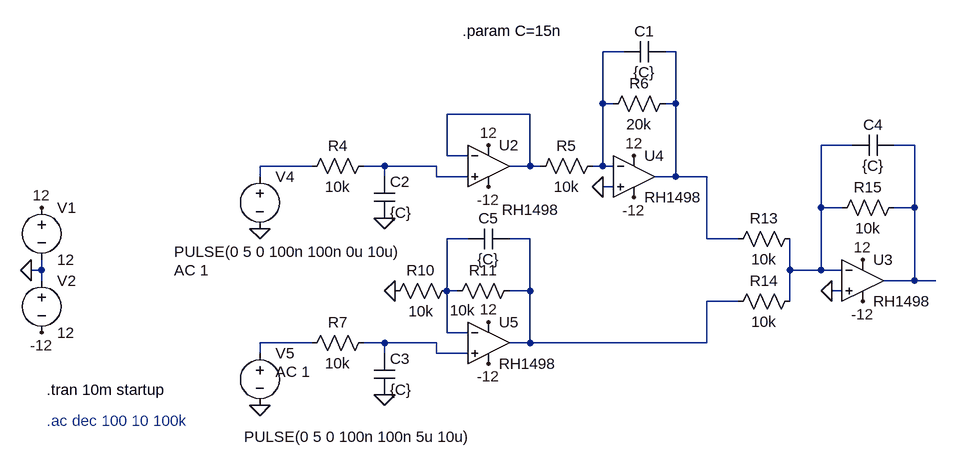
[diagram p0: schematic pwm-analog.asc]
pwm-analog.asc, the LTspice schematic file:
Version 4.1
SHEET 1 2472 680
WIRE 1712 -176 1680 -176
WIRE 1792 -176 1776 -176
WIRE 1680 -96 1680 -176
WIRE 1696 -96 1680 -96
WIRE 1792 -96 1792 -176
WIRE 1792 -96 1776 -96
WIRE 1568 -80 1440 -80
WIRE 2064 -32 2016 -32
WIRE 2160 -32 2128 -32
WIRE 1440 -16 1440 -80
WIRE 1472 -16 1440 -16
WIRE 1232 0 1152 0
WIRE 1344 0 1312 0
WIRE 1424 0 1344 0
WIRE 1568 0 1568 -80
WIRE 1568 0 1536 0
WIRE 1584 0 1568 0
WIRE 1680 0 1680 -96
WIRE 1680 0 1664 0
WIRE 1696 0 1680 0
WIRE 1152 16 1152 0
WIRE 1344 16 1344 0
WIRE 1424 16 1424 0
WIRE 1472 16 1424 16
WIRE 1792 16 1792 -96
WIRE 1792 16 1760 16
WIRE 1840 16 1792 16
WIRE 1696 32 1680 32
WIRE 2016 64 2016 -32
WIRE 2048 64 2016 64
WIRE 2160 64 2160 -32
WIRE 2160 64 2128 64
WIRE 1472 112 1440 112
WIRE 1568 112 1536 112
WIRE 1840 112 1840 16
WIRE 1888 112 1840 112
WIRE 816 160 816 144
WIRE 816 160 800 160
WIRE 1968 160 1968 112
WIRE 2016 160 2016 64
WIRE 2016 160 1968 160
WIRE 2048 160 2016 160
WIRE 816 176 816 160
WIRE 2160 176 2160 64
WIRE 2160 176 2112 176
WIRE 2192 176 2160 176
WIRE 1440 192 1440 112
WIRE 1456 192 1440 192
WIRE 1568 192 1568 112
WIRE 1568 192 1536 192
WIRE 2048 192 2032 192
WIRE 1888 208 1840 208
WIRE 1968 208 1968 160
WIRE 1440 256 1440 192
WIRE 1472 256 1440 256
WIRE 1232 272 1152 272
WIRE 1344 272 1312 272
WIRE 1424 272 1344 272
WIRE 1568 272 1568 192
WIRE 1568 272 1536 272
WIRE 1840 272 1840 208
WIRE 1840 272 1568 272
WIRE 1152 288 1152 272
WIRE 1344 288 1344 272
WIRE 1424 288 1424 272
WIRE 1472 288 1424 288
FLAG 800 160 0
FLAG 816 256 -12
FLAG 816 64 12
FLAG 1728 48 -12
FLAG 1728 -16 12
FLAG 1680 32 0
FLAG 1344 80 0
FLAG 1152 96 0
FLAG 1504 32 -12
FLAG 1504 -32 12
FLAG 1344 352 0
FLAG 1152 368 0
FLAG 1504 304 -12
FLAG 1504 240 12
FLAG 1360 192 0
FLAG 2080 208 -12
FLAG 2080 144 12
FLAG 2032 192 0
SYMBOL voltage 816 48 R0
WINDOW 123 0 0 Left 0
WINDOW 39 0 0 Left 0
SYMATTR InstName V1
SYMATTR Value 12
SYMBOL voltage 816 160 R0
WINDOW 123 0 0 Left 0
WINDOW 39 0 0 Left 0
SYMATTR InstName V2
SYMATTR Value 12
SYMBOL res 1328 -16 R90
WINDOW 0 0 56 VBottom 2
WINDOW 3 32 56 VTop 2
SYMATTR InstName R4
SYMATTR Value 10k
SYMBOL cap 1328 16 R0
SYMATTR InstName C2
SYMATTR Value {C}
SYMBOL voltage 1152 0 R0
WINDOW 3 -132 132 Left 2
WINDOW 123 -132 160 Left 2
WINDOW 39 0 0 Left 0
SYMATTR Value PULSE(0 5 0 100n 100n 0u 10u)
SYMATTR Value2 AC 1
SYMATTR InstName V4
SYMBOL res 1680 -16 R90
WINDOW 0 0 56 VBottom 2
WINDOW 3 32 56 VTop 2
SYMATTR InstName R5
SYMATTR Value 10k
SYMBOL res 1792 -112 R90
WINDOW 0 0 56 VBottom 2
WINDOW 3 32 56 VTop 2
SYMATTR InstName R6
SYMATTR Value 20k
SYMBOL OpAmps\\RH1498 1728 -48 R0
SYMATTR InstName U4
SYMBOL OpAmps\\RH1498 1504 -64 R0
WINDOW 3 21 131 Left 2
SYMATTR InstName U2
SYMBOL res 1328 256 R90
WINDOW 0 0 56 VBottom 2
WINDOW 3 32 56 VTop 2
SYMATTR InstName R7
SYMATTR Value 10k
SYMBOL cap 1328 288 R0
SYMATTR InstName C3
SYMATTR Value {C}
SYMBOL voltage 1152 272 R0
WINDOW 3 -24 144 Left 2
WINDOW 123 24 44 Left 2
WINDOW 39 0 0 Left 0
SYMATTR Value PULSE(0 5 0 100n 100n 5u 10u)
SYMATTR Value2 AC 1
SYMATTR InstName V5
SYMBOL OpAmps\\RH1498 1504 208 R0
SYMATTR InstName U5
SYMBOL res 1456 176 R90
WINDOW 0 0 56 VBottom 2
WINDOW 3 32 56 VTop 2
SYMATTR InstName R10
SYMATTR Value 10k
SYMBOL res 1552 176 R90
WINDOW 0 0 56 VBottom 2
WINDOW 3 30 88 VTop 2
SYMATTR InstName R11
SYMATTR Value 10k
SYMBOL res 1984 96 R90
WINDOW 0 0 56 VBottom 2
WINDOW 3 32 56 VTop 2
SYMATTR InstName R13
SYMATTR Value 10k
SYMBOL res 1984 192 R90
WINDOW 0 0 56 VBottom 2
WINDOW 3 32 56 VTop 2
SYMATTR InstName R14
SYMATTR Value 10k
SYMBOL OpAmps\\RH1498 2080 112 R0
SYMATTR InstName U3
SYMBOL res 2144 48 R90
WINDOW 0 0 56 VBottom 2
WINDOW 3 32 56 VTop 2
SYMATTR InstName R15
SYMATTR Value 10k
SYMBOL cap 1536 96 R90
WINDOW 0 0 32 VBottom 2
WINDOW 3 32 32 VTop 2
SYMATTR InstName C5
SYMATTR Value {C}
SYMBOL cap 1776 -192 R90
WINDOW 0 0 32 VBottom 2
WINDOW 3 32 32 VTop 2
SYMATTR InstName C1
SYMATTR Value {C}
SYMBOL cap 2128 -48 R90
WINDOW 0 0 32 VBottom 2
WINDOW 3 32 32 VTop 2
SYMATTR InstName C4
SYMATTR Value {C}
TEXT 824 344 Left 2 !.tran 10m startup
TEXT 824 392 Left 2 ;.ac dec 100 10 100k
TEXT 1464 -208 Left 2 !.param C=15n

The netlist it stands for:
* pwm-analog.asc
V1 12 0 12
V2 0 -12 12
R4 N007 N006 10k
C2 N007 0 {C}
V4 N006 0 PULSE(0 5 0 100n 100n 0u 10u) AC 1
R5 N001 N003 10k
R6 N002 N001 20k
X§U4 0 N001 12 -12 N002 RH1498  ; pins In+ In- V+ V- OUT
X§U2 N007 N003 12 -12 N003 RH1498  ; pins In+ In- V+ V- OUT
R7 N011 N010 10k
C3 N011 0 {C}
V5 N010 0 PULSE(0 5 0 100n 100n 5u 10u) AC 1
X§U5 N011 N008 12 -12 N009 RH1498  ; pins In+ In- V+ V- OUT
R10 N008 0 10k
R11 N009 N008 10k
R13 N004 N002 10k
R14 N004 N009 10k
X§U3 0 N004 12 -12 N005 RH1498  ; pins In+ In- V+ V- OUT
R15 N005 N004 10k
C5 N009 N008 {C}
C1 N002 N001 {C}
C4 N005 N004 {C}
.tran 10m startup
* .ac dec 100 10 100k
.param C=15n
.backanno
.end